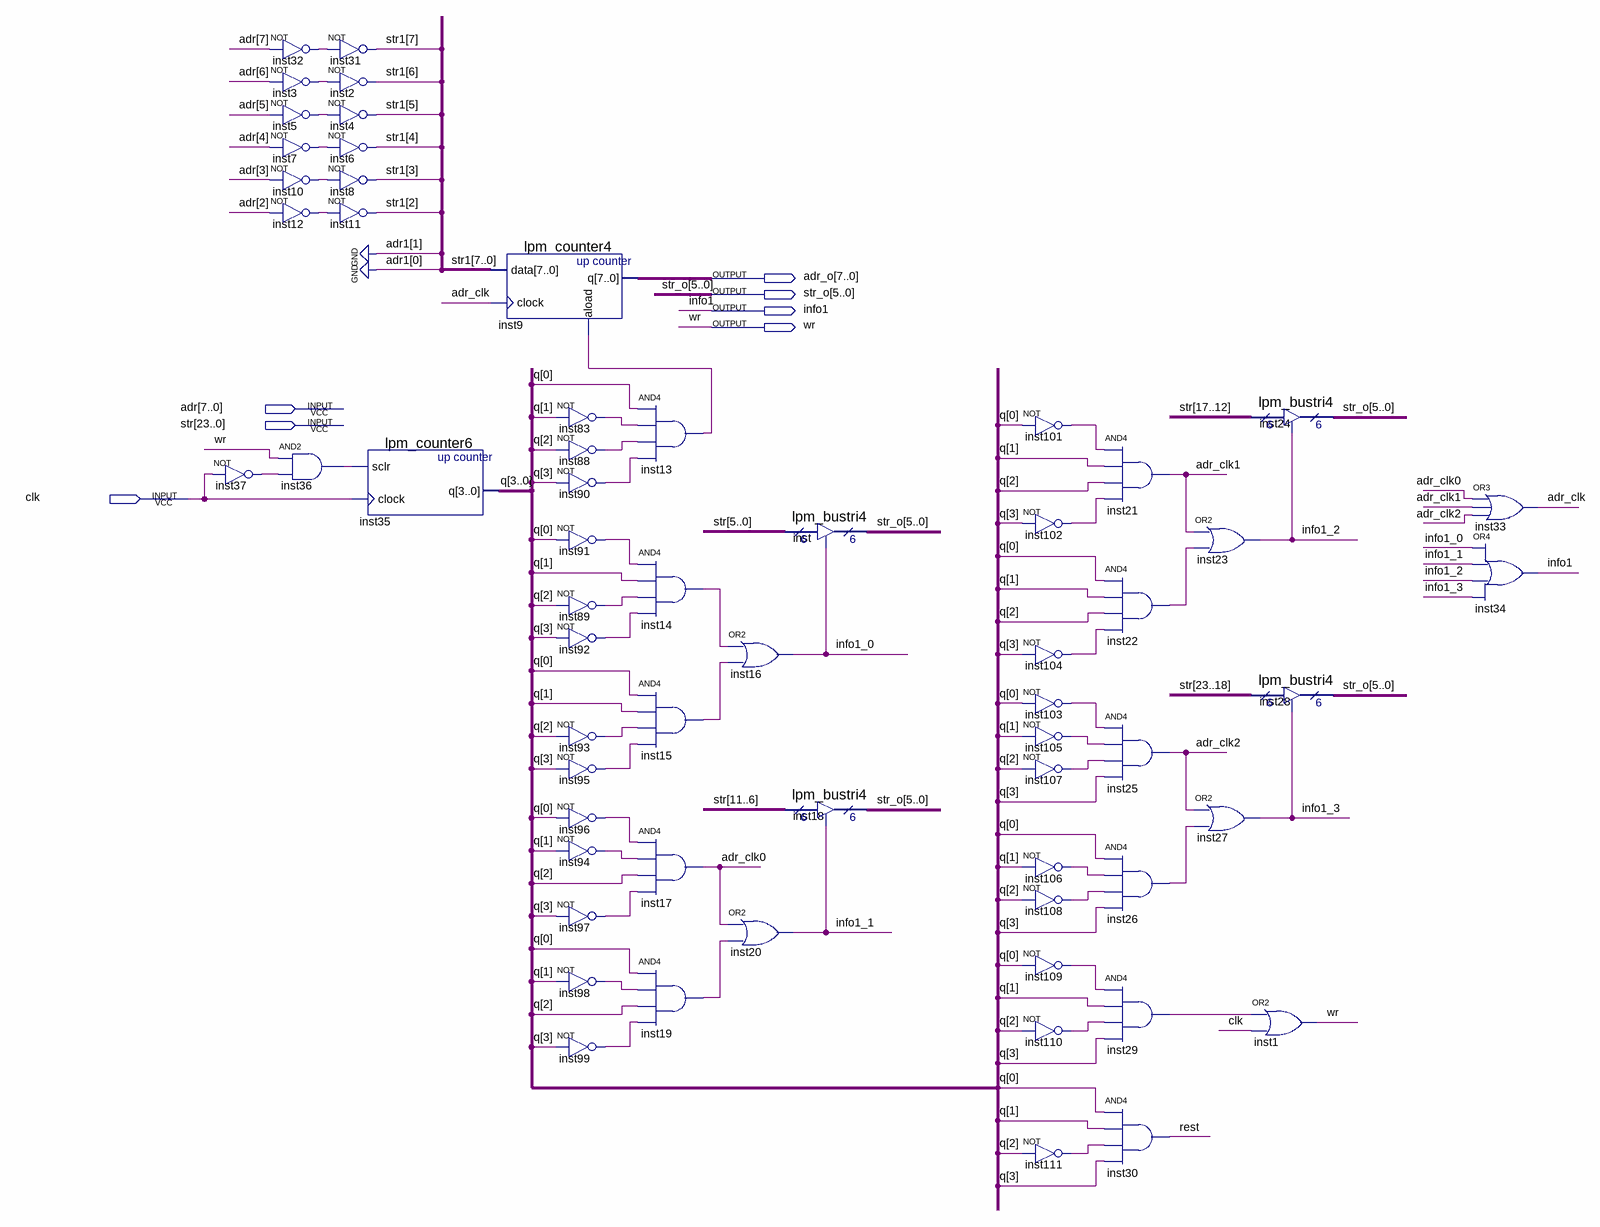
[diagram p0: schematic sheet]
// Quartus schematic write_to_ram.bdf as structural Verilog: 62 symbols, 7 pins
module write_to_ram (
  input  [7:0] adr,
  input  [23:0] str,
  input  clk,
  output [7:0] adr_o,
  output [5:0] str_o,
  output info1,
  output wr
);

  wire adr_clk, adr_clk0, adr_clk1, adr_clk2, info1_0, info1_1, info1_2, info1_3, inst3_out, inst5_out,
       inst7_out, inst10_out, inst12_out, inst13_out, inst14_out, inst15_out, inst19_out, inst22_out,
       inst26_out, inst29_out, inst32_out, inst36_out, inst37_out, inst83_out, inst88_out, inst89_out,
       inst90_out, inst91_out, inst92_out, inst93_out, inst94_out, inst95_out, inst96_out, inst97_out,
       inst98_out, inst99_out, inst101_out, inst102_out, inst103_out, inst104_out, inst105_out, inst106_out,
       inst107_out, inst108_out, inst109_out, inst110_out, inst111_out, rest;
  wire [3:0] q;
  wire [7:0] str1;

  not inst32 (inst32_out, adr[7]);
  not inst3 (inst3_out, adr[6]);
  not inst5 (inst5_out, adr[5]);
  not inst7 (inst7_out, adr[4]);
  not inst10 (inst10_out, adr[3]);
  not inst12 (inst12_out, adr[2]);
  not inst37 (inst37_out, clk);
  not inst31 (str1[7], inst32_out);
  not inst2 (str1[6], inst3_out);
  not inst4 (str1[5], inst5_out);
  not inst6 (str1[4], inst7_out);
  not inst8 (str1[3], inst10_out);
  not inst11 (str1[2], inst12_out);
  and inst36 (inst36_out, wr, inst37_out);
  lpm_counter6 inst35 (.sclr(inst36_out), .clock(clk), .q(q));
  lpm_counter4 inst9 (.data(str1), .clock(adr_clk), .aload(inst13_out), .q(adr_o));
  not inst83 (inst83_out, q[1]);
  not inst88 (inst88_out, q[2]);
  not inst90 (inst90_out, q[3]);
  not inst91 (inst91_out, q[0]);
  not inst89 (inst89_out, q[2]);
  not inst92 (inst92_out, q[3]);
  not inst93 (inst93_out, q[2]);
  not inst95 (inst95_out, q[3]);
  not inst96 (inst96_out, q[0]);
  not inst94 (inst94_out, q[1]);
  not inst97 (inst97_out, q[3]);
  not inst98 (inst98_out, q[1]);
  not inst99 (inst99_out, q[3]);
  and inst13 (inst13_out, q[0], inst83_out, inst88_out, inst90_out);
  and inst14 (inst14_out, inst91_out, q[1], inst89_out, inst92_out);
  and inst15 (inst15_out, q[0], q[1], inst93_out, inst95_out);
  and inst17 (adr_clk0, inst96_out, inst94_out, q[2], inst97_out);
  and inst19 (inst19_out, q[0], inst98_out, q[2], inst99_out);
  or inst16 (info1_0, inst14_out, inst15_out);
  or inst20 (info1_1, adr_clk0, inst19_out);
  lpm_bustri4 inst (.enabledt(info1_0), .data(str[5:0]), .tridata(str_o));
  lpm_bustri4 inst18 (.enabledt(info1_1), .data(str[11:6]), .tridata(str_o));
  not inst101 (inst101_out, q[0]);
  not inst102 (inst102_out, q[3]);
  not inst104 (inst104_out, q[3]);
  not inst103 (inst103_out, q[0]);
  not inst105 (inst105_out, q[1]);
  not inst107 (inst107_out, q[2]);
  not inst106 (inst106_out, q[1]);
  not inst108 (inst108_out, q[2]);
  not inst109 (inst109_out, q[0]);
  not inst110 (inst110_out, q[2]);
  not inst111 (inst111_out, q[2]);
  and inst21 (adr_clk1, inst101_out, q[1], q[2], inst102_out);
  and inst22 (inst22_out, q[0], q[1], q[2], inst104_out);
  and inst25 (adr_clk2, inst103_out, inst105_out, inst107_out, q[3]);
  and inst26 (inst26_out, q[0], inst106_out, inst108_out, q[3]);
  and inst29 (inst29_out, inst109_out, q[1], inst110_out, q[3]);
  and inst30 (rest, q[0], q[1], inst111_out, q[3]);
  lpm_bustri4 inst24 (.enabledt(info1_2), .data(str[17:12]), .tridata(str_o));
  or inst23 (info1_2, adr_clk1, inst22_out);
  lpm_bustri4 inst28 (.enabledt(info1_3), .data(str[23:18]), .tridata(str_o));
  or inst27 (info1_3, adr_clk2, inst26_out);
  or inst1 (wr, inst29_out, clk);
  or inst33 (adr_clk, adr_clk0, adr_clk1, adr_clk2);
  or inst34 (info1, info1_0, info1_1, info1_2, info1_3);
endmodule
